# Altium schematic sheet LPCB235 - RM48 - MAIN.SchDoc
size A3; Address1: Unit 4; DocumentNumber: 28; Revision: 2; SheetNumber: 28; SheetTotal: 37; Lockie__PCB_SUB_ASSEMBLY: Main; Lockie__PCB_ASSEMBLY: FCU PCB; Lockie__LDL: LPCB235; Lockie__PCB_DESCRIPTION: Flight Control Unit
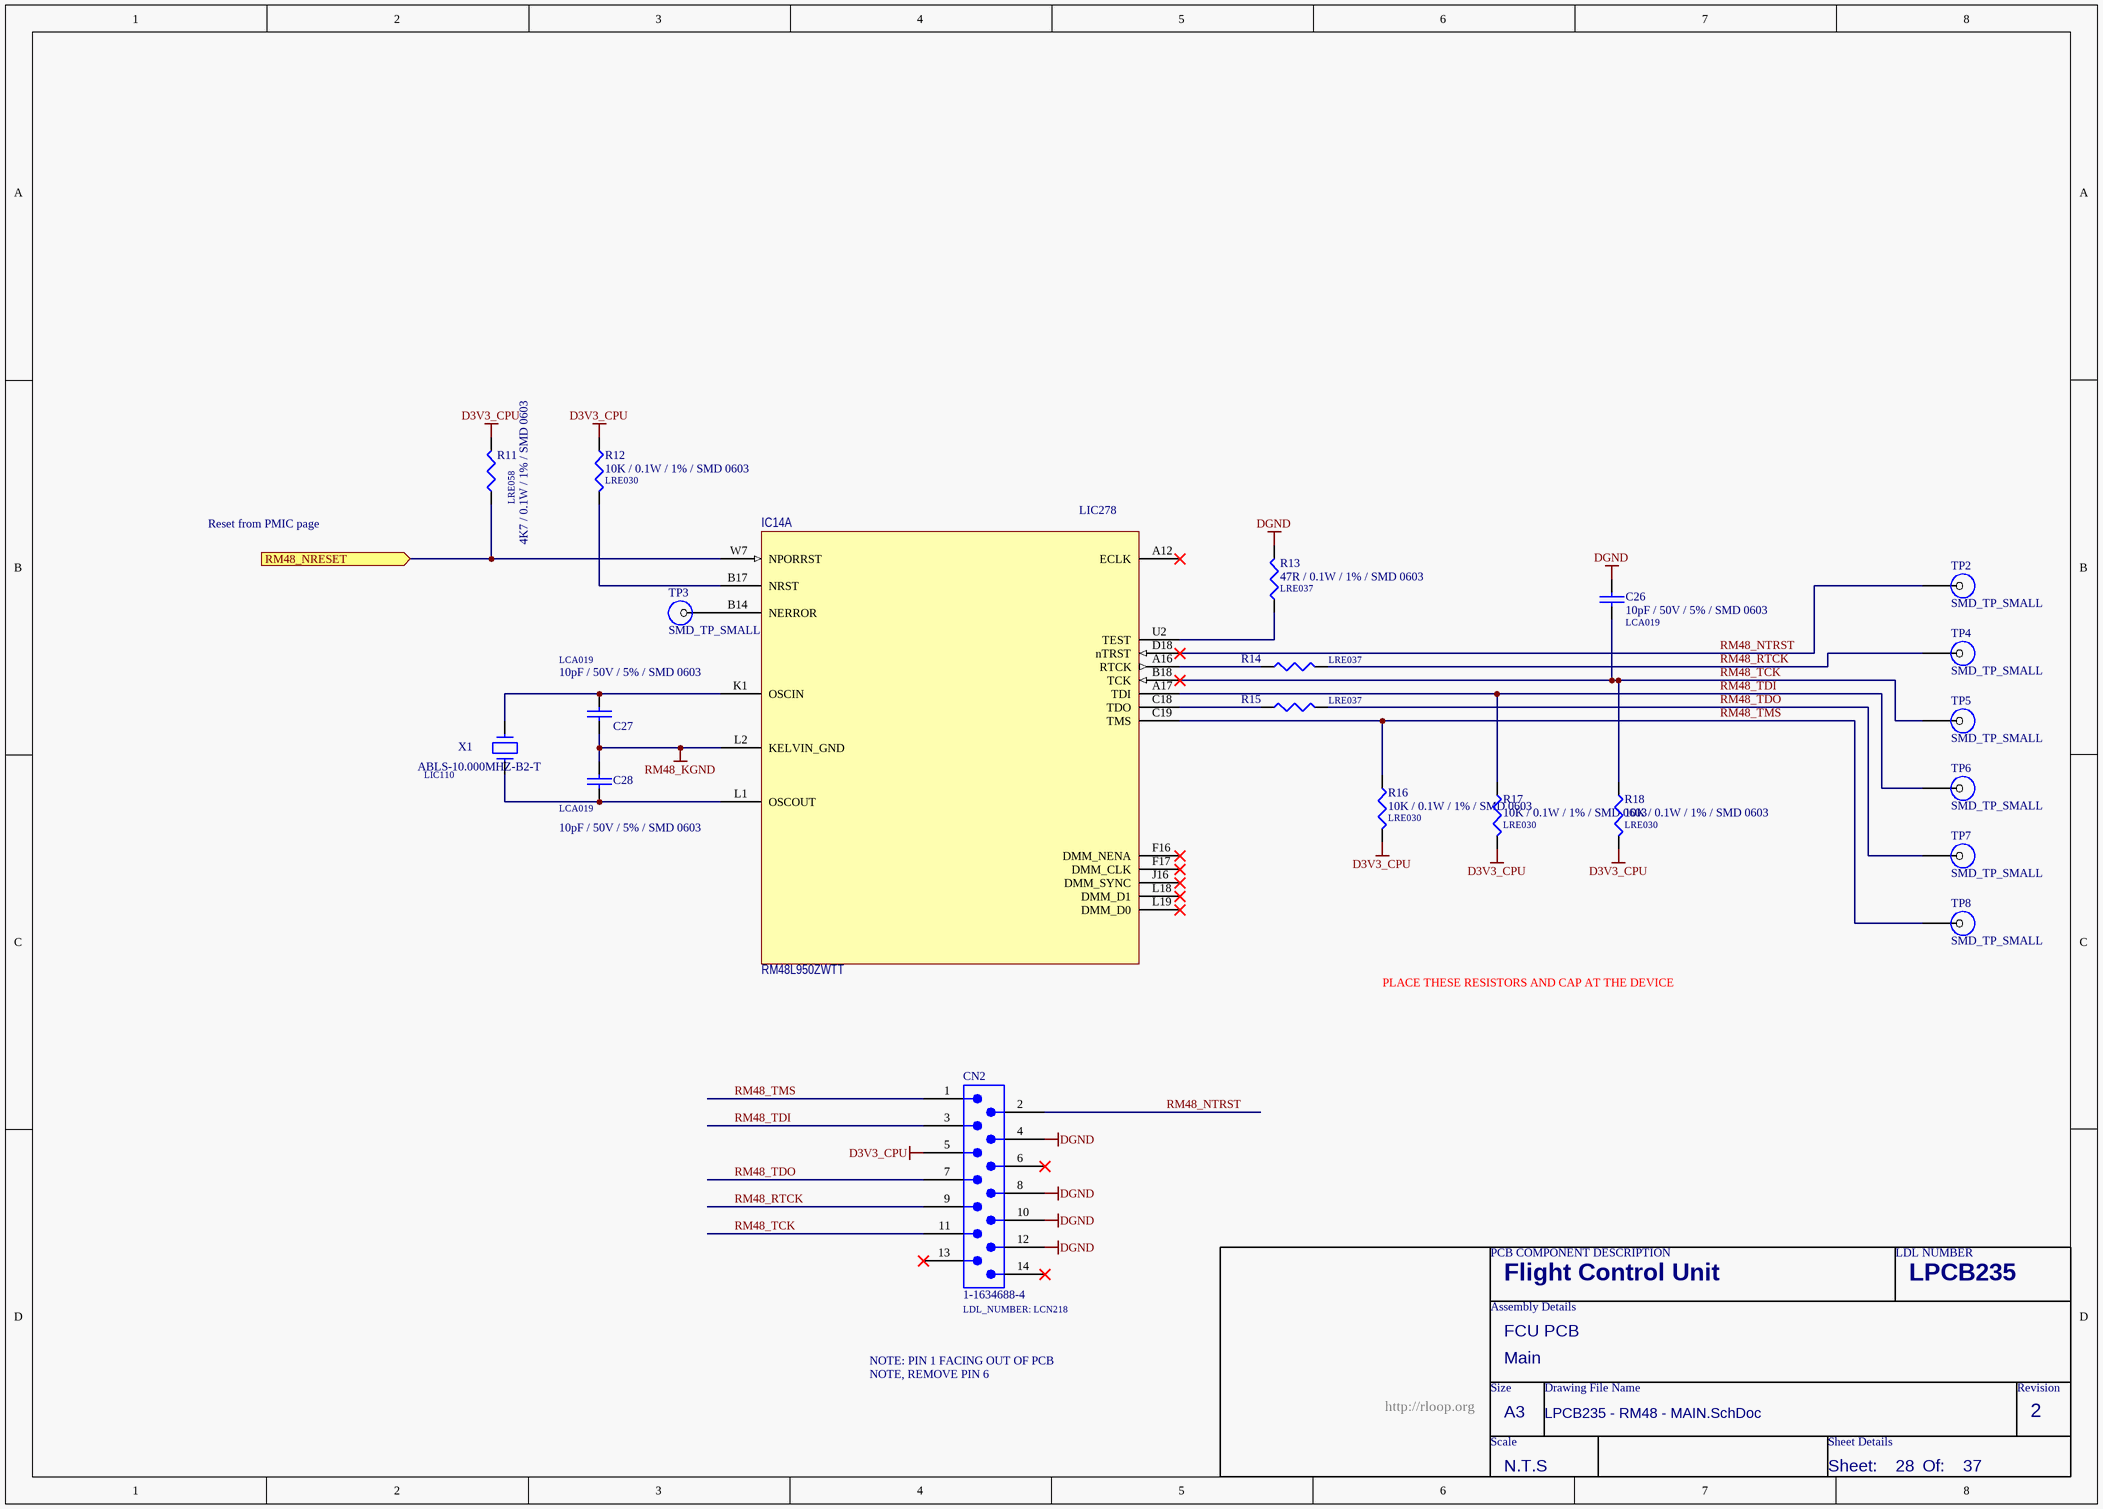
[diagram p0: LPCB235 - RM48 - MAIN.SchDoc]

## Parts
C26  10pF / 50V / 5% / SMD 0603  LDL_NUMBER: LCA019  [LFP011__CC1608-0603-IPC7351_B]
C27  10pF / 50V / 5% / SMD 0603  LDL_NUMBER: LCA019  [LFP011__CC1608-0603-IPC7351_B]
C28  10pF / 50V / 5% / SMD 0603  LDL_NUMBER: LCA019  [LFP011__CC1608-0603-IPC7351_B]
CN2  1-1634688-4  LDL_NUMBER: LCN218  [1-1634688-4]
IC14  RM48L950ZWTT  LDL_NUMBER: LIC278  [LFP054__ZWT (S-PBGA-N337)]  (part A of 10)
R11  4K7 / 0.1W / 1% / SMD 0603  LDL_NUMBER: LRE058  [LFP020__CR1608-0603-IPC7351_B]
R12  10K / 0.1W / 1% / SMD 0603  LDL_NUMBER: LRE030  [LFP020__CR1608-0603-IPC7351_B]
R13  47R / 0.1W / 1% / SMD 0603  LDL_NUMBER: LRE037  [LFP020__CR1608-0603-IPC7351_B]
R14  LDL_NUMBER: LRE037  [LFP020__CR1608-0603-IPC7351_B]  (hidden comment: 47R / 0.1W / 1% / SMD 0603)
R15  LDL_NUMBER: LRE037  [LFP020__CR1608-0603-IPC7351_B]  (hidden comment: 47R / 0.1W / 1% / SMD 0603)
R16  10K / 0.1W / 1% / SMD 0603  LDL_NUMBER: LRE030  [LFP020__CR1608-0603-IPC7351_B]
R17  10K / 0.1W / 1% / SMD 0603  LDL_NUMBER: LRE030  [LFP020__CR1608-0603-IPC7351_B]
R18  10K / 0.1W / 1% / SMD 0603  LDL_NUMBER: LRE030  [LFP020__CR1608-0603-IPC7351_B]
TP2  SMD_TP_SMALL  [SMD-TP-SMALL]  (no BOM)
TP3  SMD_TP_SMALL  [SMD-TP-SMALL]  (no BOM)
TP4  SMD_TP_SMALL  [SMD-TP-SMALL]  (no BOM)
TP5  SMD_TP_SMALL  [SMD-TP-SMALL]  (no BOM)
TP6  SMD_TP_SMALL  [SMD-TP-SMALL]  (no BOM)
TP7  SMD_TP_SMALL  [SMD-TP-SMALL]  (no BOM)
TP8  SMD_TP_SMALL  [SMD-TP-SMALL]  (no BOM)
X1  ABLS-10.000MHZ-B2-T  LDL_NUMBER: LIC110  [LFP022__XT49M]

## Ports
RM48_NRESET (in)

## Nets
D3V3_CPU: CN2.5 R11.2 R12.1 R16.2 R17.2 R18.2
DGND: C26.2 CN2.4 CN2.8 CN2.10 CN2.12 R13.2
RM48_KGND: C27.2 C28.1 IC14.L2(KELVIN_GND)
RM48_NRESET: IC14.W7(NPORRST) R11.1 ; port RM48_NRESET
RM48_NTRST: CN2.2 IC14.D18(nTRST) TP2.1
RM48_RTCK: CN2.9 R14.2 TP4.1
RM48_TCK: C26.1 CN2.11 IC14.B18(TCK) R18.1 TP5.1
RM48_TDI: CN2.3 IC14.A17(TDI) R17.1 TP6.1
RM48_TDO: CN2.7 R15.2 TP7.1
RM48_TMS: CN2.1 IC14.C19(TMS) R16.1 TP8.1
NetC27_1: C27.1 IC14.K1(OSCIN) X1.2
NetC28_2: C28.2 IC14.L1(OSCOUT) X1.1
NetIC14_A16: IC14.A16(RTCK) R14.1
NetIC14_B14: IC14.B14(NERROR) TP3.1
NetIC14_B17: IC14.B17(NRST) R12.2
NetIC14_C18: IC14.C18(TDO) R15.1
NetIC14_U2: IC14.U2(TEST) R13.1

Not connected (* = marked no-connect by the designer): CN2 6* 13* 14*; IC14 A12(ECLK)* F16(DMM_NENA)* F17(DMM_CLK)* J16(DMM_SYNC)* L18(DMM_D1)* L19(DMM_D0)*

## Notes on the sheet
- Reset from PMIC page
- PLACE THESE RESISTORS AND CAP AT THE DEVICE
- NOTE: PIN 1 FACING OUT OF PCB
- NOTE, REMOVE PIN 6
- PCB COMPONENT DESCRIPTION
- LDL NUMBER
- Assembly Details
- Size
- Drawing File Name
- Revision
- http://rloop.org
- Scale
- A3
- Sheet Details
- N.T.S
- Sheet:
- Of:

## Library data of the parts
C26-C28 = 10pF / 50V / 5% / SMD 0603: Capacitor, Ceramic Chip, 10pF, 50V, 5%, SMD 0603 [LCA019]; Value: 10p; FMEDA__OPERATING__VOLTAGE_MAX: 3.3; FMEDA__OPERATING__VOLTAGE_MIN: 0; FMEDA__OPERATING__TEMP_MAX: 50; FMEDA__OPERATING__TEMP_MIN: -20; FMEDA__OPERATING__TEMP_TYP: 27; FMEDA__CHANNEL: COM; FMEDA__FUNCTION_IN_SYSTEM: *; FMEDA__OPERATING__VOLTAGE_TYP: 3.3
CN2 = 1-1634688-4: Connector, Box Header, 14 Way, 2.54mm Straight, PTH; FMEDA__CHANNEL: COM; FMEDA__OPERATING__CURRENT_MAX: 0; FMEDA__OPERATING__TEMP_MAX: 50; FMEDA__OPERATING__TEMP_MIN: -20; FMEDA__OPERATING__TEMP_TYP: 27; FMEDA__OPERATING__VOLTAGE_MAX: 16; FMEDA__OPERATING__VOLTAGE_TYP: 12; FMEDA__OPERATING__CURRENT_MIN: 0; FMEDA__OPERATING__CURRENT_TYP: 0; FMEDA__OPERATING__VOLTAGE_MIN: 0
IC14 = RM48L950ZWTT: IC, CPU, RM48 Safety CPU, SMD NFBGA337 [LIC278]; FMEDA__FUNCTION_IN_SYSTEM: SAFETY CPU 1; FMEDA__OPERATING__TEMP_MIN: -20; FMEDA__OPERATING__TEMP_TYP: 27; FMEDA__OPERATING__TEMP_MAX: 50; FMEDA__CHANNEL: COM
R11 = 4K7 / 0.1W / 1% / SMD 0603: Resistor, Ceramic Chip, 4K7, 0.1W, 1%, SMD 0603 [LRE058]; VALUE: 4.7K; FMEDA__OPERATING__POWER_MAX: 0; FMEDA__OPERATING__TEMP_MAX: 50; FMEDA__OPERATING__TEMP_MIN: -20; FMEDA__OPERATING__TEMP_TYP: 27; FMEDA__CHANNEL: COM; FMEDA__OPERATING__POWER_MIN: 0; FMEDA__OPERATING__VOLTAGE_MAX: 0; FMEDA__OPERATING__VOLTAGE_MIN: 0; FMEDA__OPERATING__VOLTAGE_TYP: 0; FMEDA__FUNCTION_IN_SYSTEM: *
R12 R16-R18 = 10K / 0.1W / 1% / SMD 0603: Resistor, Ceramic Chip, 10K, 0.1W, 1%, SMD 0603 [LRE030]; FMEDA__OPERATING__POWER_MAX: 0; FMEDA__OPERATING__TEMP_MAX: 50; FMEDA__OPERATING__TEMP_MIN: -20; FMEDA__OPERATING__TEMP_TYP: 27; FMEDA__CHANNEL: COM; Value: 10K; FMEDA__OPERATING__POWER_MIN: 0; FMEDA__OPERATING__VOLTAGE_MAX: 0; FMEDA__OPERATING__VOLTAGE_MIN: 0; FMEDA__OPERATING__VOLTAGE_TYP: 0; FMEDA__FUNCTION_IN_SYSTEM: *
R13-R15 = 47R / 0.1W / 1% / SMD 0603: Resistor, Ceramic Chip, 47R, 0.1W, 1%, SMD 0603 [LRE037]; VALUE: 47; FMEDA__OPERATING__POWER_MAX: 0; FMEDA__OPERATING__TEMP_MAX: 50; FMEDA__OPERATING__TEMP_MIN: -20; FMEDA__OPERATING__TEMP_TYP: 27; FMEDA__CHANNEL: COM; FMEDA__OPERATING__POWER_MIN: 0; FMEDA__OPERATING__VOLTAGE_MAX: 0; FMEDA__OPERATING__VOLTAGE_MIN: 0; FMEDA__OPERATING__VOLTAGE_TYP: 0; FMEDA__FUNCTION_IN_SYSTEM: *
TP2-TP8 = SMD_TP_SMALL: SMD Test Point; FMEDA__CHANNEL: COM; FMEDA__OPERATING__CURRENT_MAX: 0; FMEDA__OPERATING__TEMP_MAX: 50; FMEDA__OPERATING__TEMP_MIN: -20; FMEDA__OPERATING__TEMP_TYP: 27; FMEDA__OPERATING__VOLTAGE_MAX: 16; FMEDA__OPERATING__VOLTAGE_TYP: 12; FMEDA__OPERATING__CURRENT_MIN: 0; FMEDA__OPERATING__CURRENT_TYP: 0; FMEDA__OPERATING__VOLTAGE_MIN: 0
X1 = ABLS-10.000MHZ-B2-T: Crystal, 10MHz, 18pF, SMD [LIC110]; FMEDA__OPERATING__TEMP_MAX: 50; FMEDA__OPERATING__TEMP_TYP: 27; FMEDA__OPERATING__TEMP_MIN: -20; FMEDA__CHANNEL: COM; FMEDA__FUNCTION_IN_SYSTEM: *